# EAGLE design board (EAGLE 9.2.2)

## Sheet 1 of 4: MCU and Motors
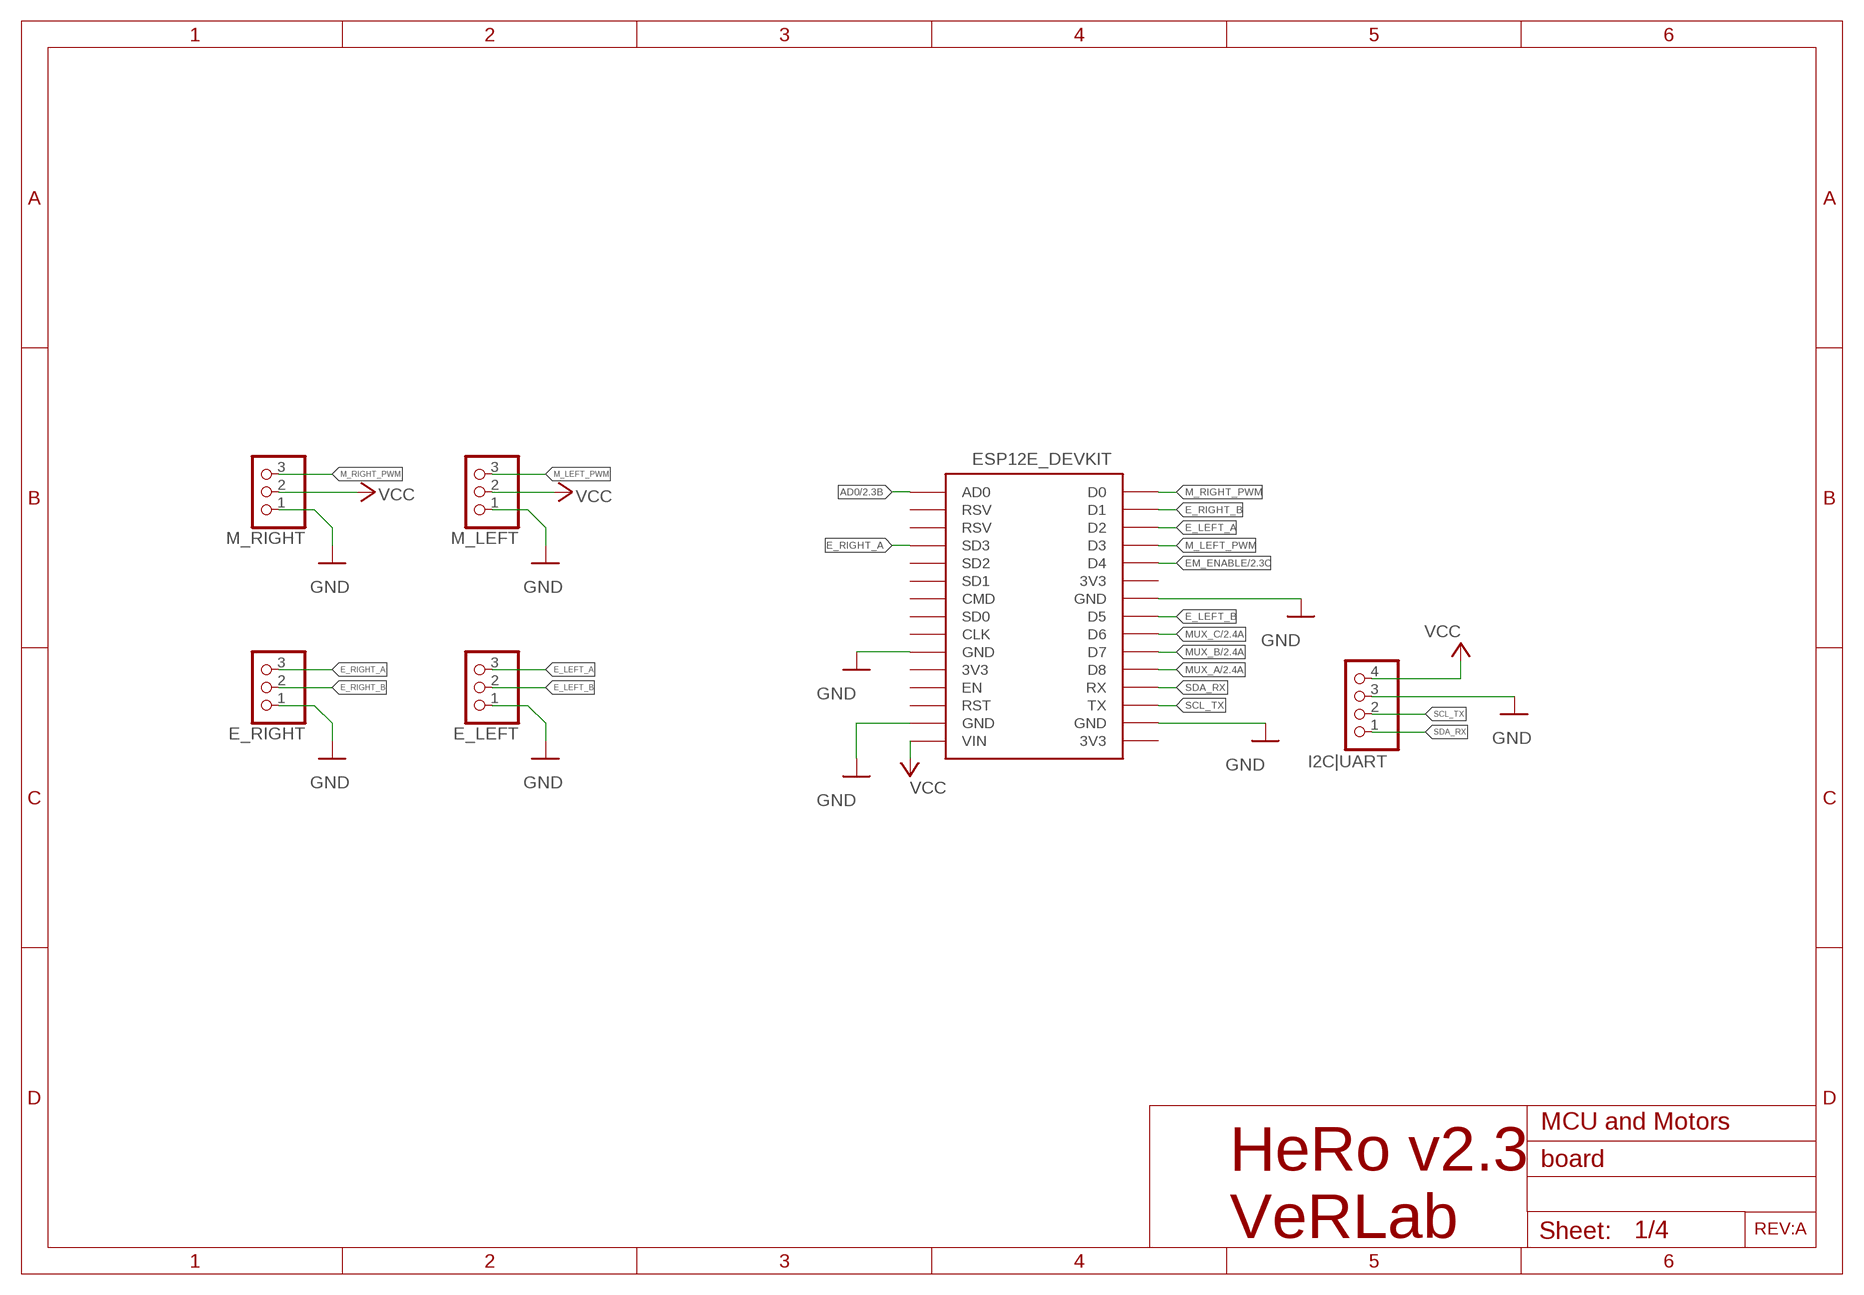
[diagram p0: schematic, sheet 1]
FRAME2 (A4L-LOC): TITLE: MCU and Motors

### Parts
E_LEFT  PINHD-1X3  [1X03]
E_RIGHT  PINHD-1X3  [1X03]
I2C|UART  PINHD-1X4  [1X04]
M_LEFT  PINHD-1X3  [1X03]
M_RIGHT  PINHD-1X3  [1X03]
U$1  ESP12E_DEVKIT  [ESP12E_DEVKIT]

### Nets
AD0: U$1.AD0 ; also sheet 2
E_LEFT_A: E_LEFT.3 U$1.D2
E_LEFT_B: E_LEFT.2 U$1.D5
E_RIGHT_A: E_RIGHT.3 U$1.SD3
E_RIGHT_B: E_RIGHT.2 U$1.D1
EM_ENABLE: U$1.D4 ; also sheet 2,3
GND: E_LEFT.1 E_RIGHT.1 I2C|UART.3 M_LEFT.1 M_RIGHT.1 U$1.GND@0(GND) U$1.GND@1(GND) U$1.GND@2(GND) U$1.GND@3(GND) ; also sheet 2,3,4
M_LEFT_PWM: M_LEFT.3 U$1.D3
M_RIGHT_PWM: M_RIGHT.3 U$1.D0
MUX_A: U$1.D8 ; also sheet 2
MUX_B: U$1.D7 ; also sheet 2
MUX_C: U$1.D6 ; also sheet 2
SCL_TX: I2C|UART.2 U$1.TX
SDA_RX: I2C|UART.1 U$1.RX
VCC: I2C|UART.4 M_LEFT.2 M_RIGHT.2 U$1.VIN ; also sheet 2,3,4
Unconnected: U$1.3V3@0(3V3) U$1.3V3@1(3V3) U$1.3V3@2(3V3) U$1.CLK U$1.CMD U$1.EN U$1.RST U$1.RSV@0(RSV) U$1.RSV@1(RSV) U$1.SD0 U$1.SD1 U$1.SD2

### Notes on the sheet
- REV:A
- HeRo v2.3
  VeRLab

## Sheet 2 of 4: Proximity Sensors
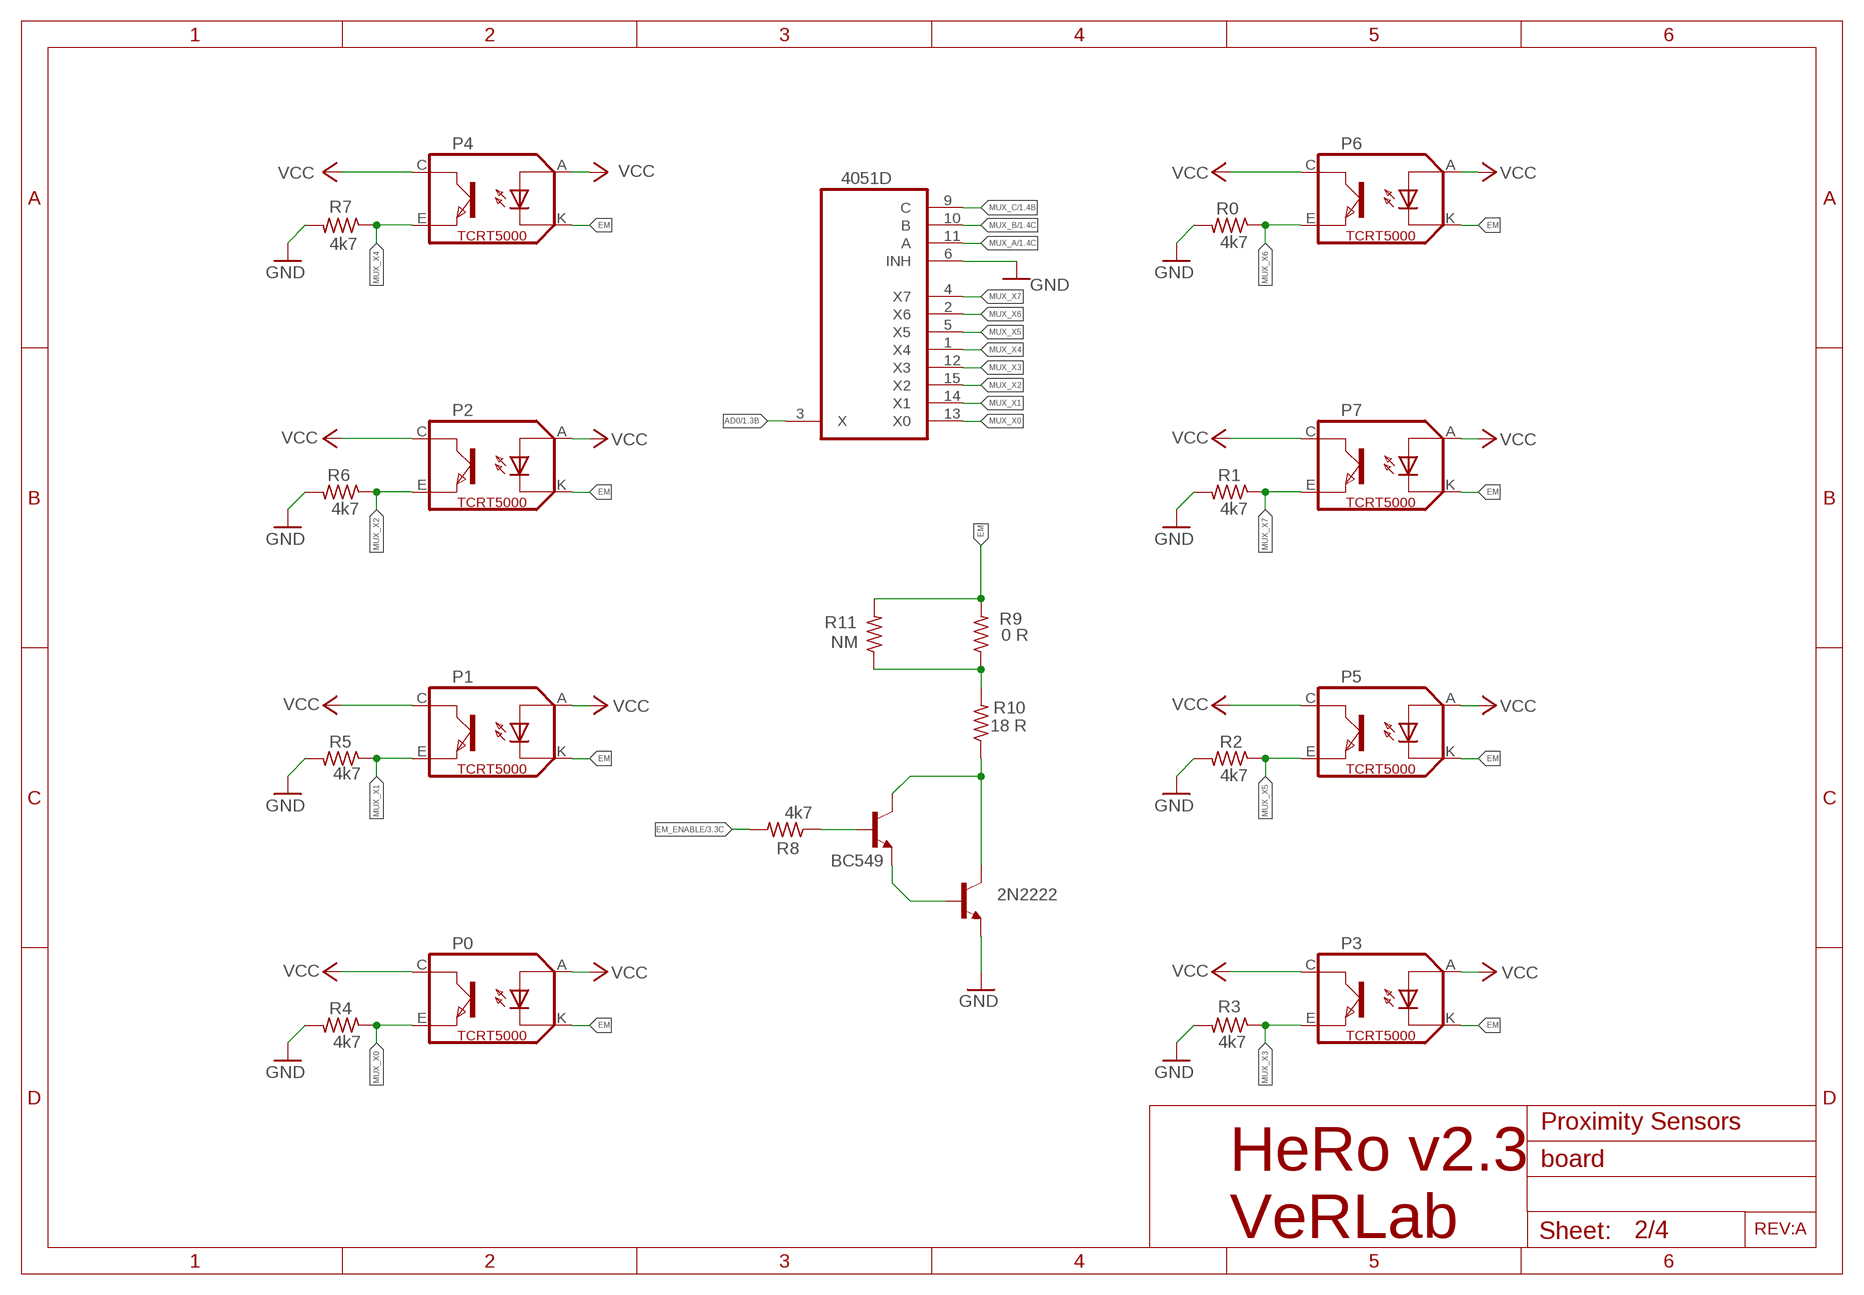
[diagram p1: schematic, sheet 2]
FRAME1 (A4L-LOC): TITLE: Proximity Sensors

### Parts
BC549  BC549-NPN-TO92-CBE  [TO92-CBE]
IC2  4051D  [SO16]
P0  TCRT5000  [TCRT5000]
P1  TCRT5000  [TCRT5000]
P2  TCRT5000  [TCRT5000]
P3  TCRT5000  [TCRT5000]
P4  TCRT5000  [TCRT5000]
P5  TCRT5000  [TCRT5000]
P6  TCRT5000  [TCRT5000]
P7  TCRT5000  [TCRT5000]
R0  4k7  R-US_M0805  [M0805]
R1  4k7  R-US_M0805  [M0805]
R2  4k7  R-US_M0805  [M0805]
R3  4k7  R-US_M0805  [M0805]
R4  4k7  R-US_M0805  [M0805]
R5  4k7  R-US_M0805  [M0805]
R6  4k7  R-US_M0805  [M0805]
R7  4k7  R-US_M0805  [M0805]
R8  4k7  R-US_R0805  [R0805]
R9  0 R  R-US_R0805  [R0805]
R10  18 R  R-US_R0805  [R0805]
R11  NM  R-US_R0805  [R0805]
T5  2N2222  [TO92-EBC-OVAL]

### Nets
AD0: IC2.3(X) ; also sheet 1
EM: P0.K(CATHODE) P1.K(CATHODE) P2.K(CATHODE) P3.K(CATHODE) P4.K(CATHODE) P5.K(CATHODE) P6.K(CATHODE) P7.K(CATHODE) R9.2 R11.2
EM_ENABLE: R8.2 ; also sheet 1,3
EM_ENABLE_RES: BC549.B R8.1
GND: IC2.6(INH) R0.2 R1.2 R2.2 R3.2 R4.2 R5.2 R6.2 R7.2 T5.E ; also sheet 1,3,4
MUX_A: IC2.11(A) ; also sheet 1
MUX_B: IC2.10(B) ; also sheet 1
MUX_C: IC2.9(C) ; also sheet 1
MUX_X0: IC2.13(X0) P0.E(EMITTER) R4.1
MUX_X1: IC2.14(X1) P1.E(EMITTER) R5.1
MUX_X2: IC2.15(X2) P2.E(EMITTER) R6.1
MUX_X3: IC2.12(X3) P3.E(EMITTER) R3.1
MUX_X4: IC2.1(X4) P4.E(EMITTER) R7.1
MUX_X5: IC2.5(X5) P5.E(EMITTER) R2.1
MUX_X6: IC2.2(X6) P6.E(EMITTER) R0.1
MUX_X7: IC2.4(X7) P7.E(EMITTER) R1.1
N$4: R9.1 R10.2 R11.1
N$6: BC549.C R10.1 T5.C
N$7: BC549.E T5.B
VCC: P0.A(ANODE) P0.C(COLLECTOR) P1.A(ANODE) P1.C(COLLECTOR) P2.A(ANODE) P2.C(COLLECTOR) P3.A(ANODE) P3.C(COLLECTOR) P4.A(ANODE) P4.C(COLLECTOR) P5.A(ANODE) P5.C(COLLECTOR) P6.A(ANODE) P6.C(COLLECTOR) P7.A(ANODE) P7.C(COLLECTOR) ; also sheet 1,3,4

### Notes on the sheet
- REV:A
- HeRo v2.3
  VeRLab

## Sheet 3 of 4: LED RGB
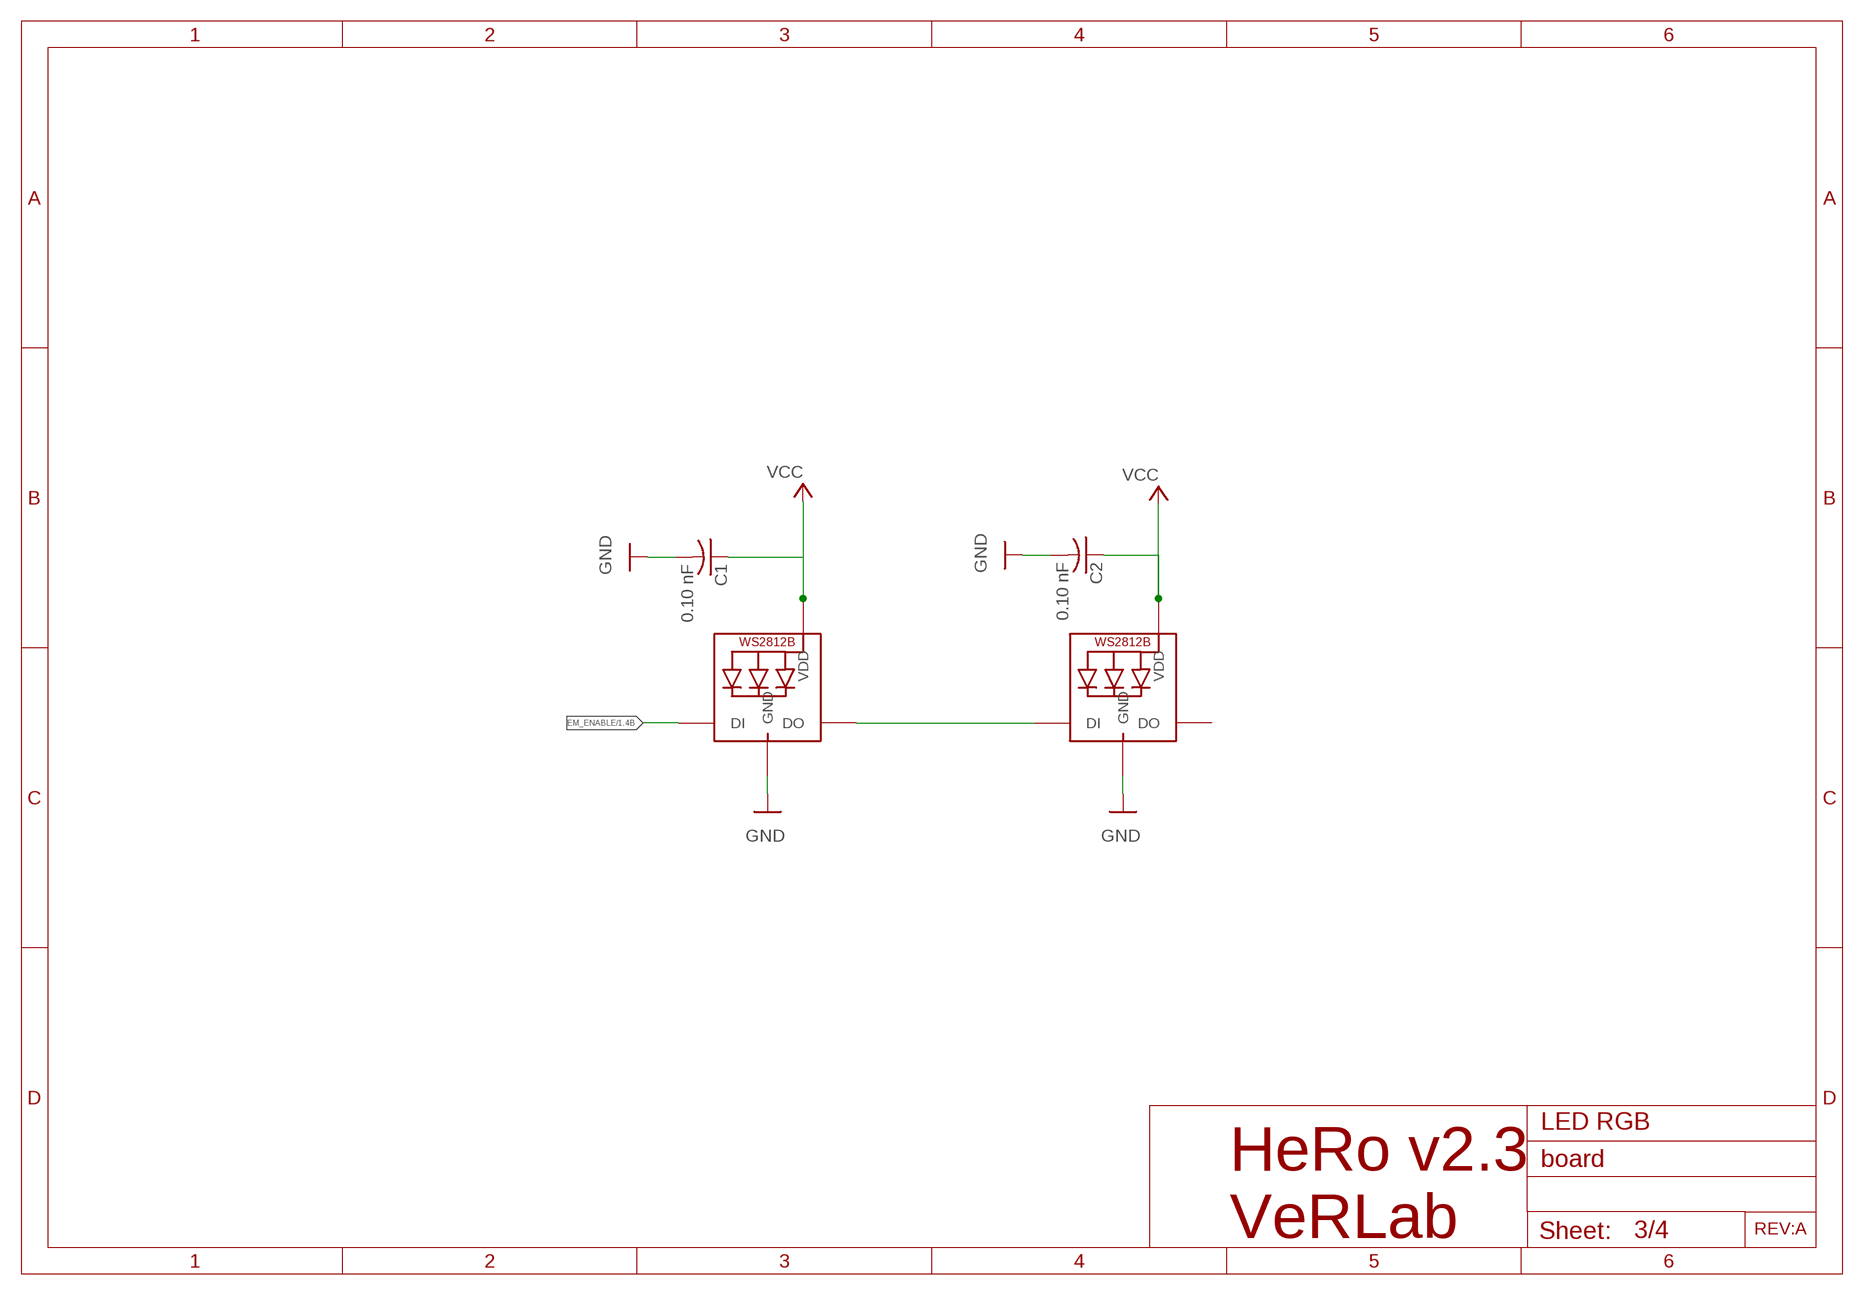
[diagram p2: schematic, sheet 3]
FRAME3 (A4L-LOC): TITLE: LED RGB

### Parts
C1  0.10 nF  C-USC0603  [C0603]
C2  0.10 nF  C-USC0603  [C0603]
LED3  WS2812B5050  [WS2812B]
LED4  WS2812B5050  [WS2812B]

### Nets
EM_ENABLE: LED3.4-DIN(DI) ; also sheet 1,2
GND: C1.2 C2.2 LED3.3-GND(GND) LED4.3-GND(GND) ; also sheet 1,2,4
VCC: C1.1 C2.1 LED3.1-VDD(VDD) LED4.1-VDD(VDD) ; also sheet 1,2,4
WS_OUT: LED3.2-DOUT(DO) LED4.4-DIN(DI)
Unconnected: LED4.2-DOUT(DO)

### Notes on the sheet
- REV:A
- HeRo v2.3
  VeRLab

## Sheet 4 of 4: Power Supply
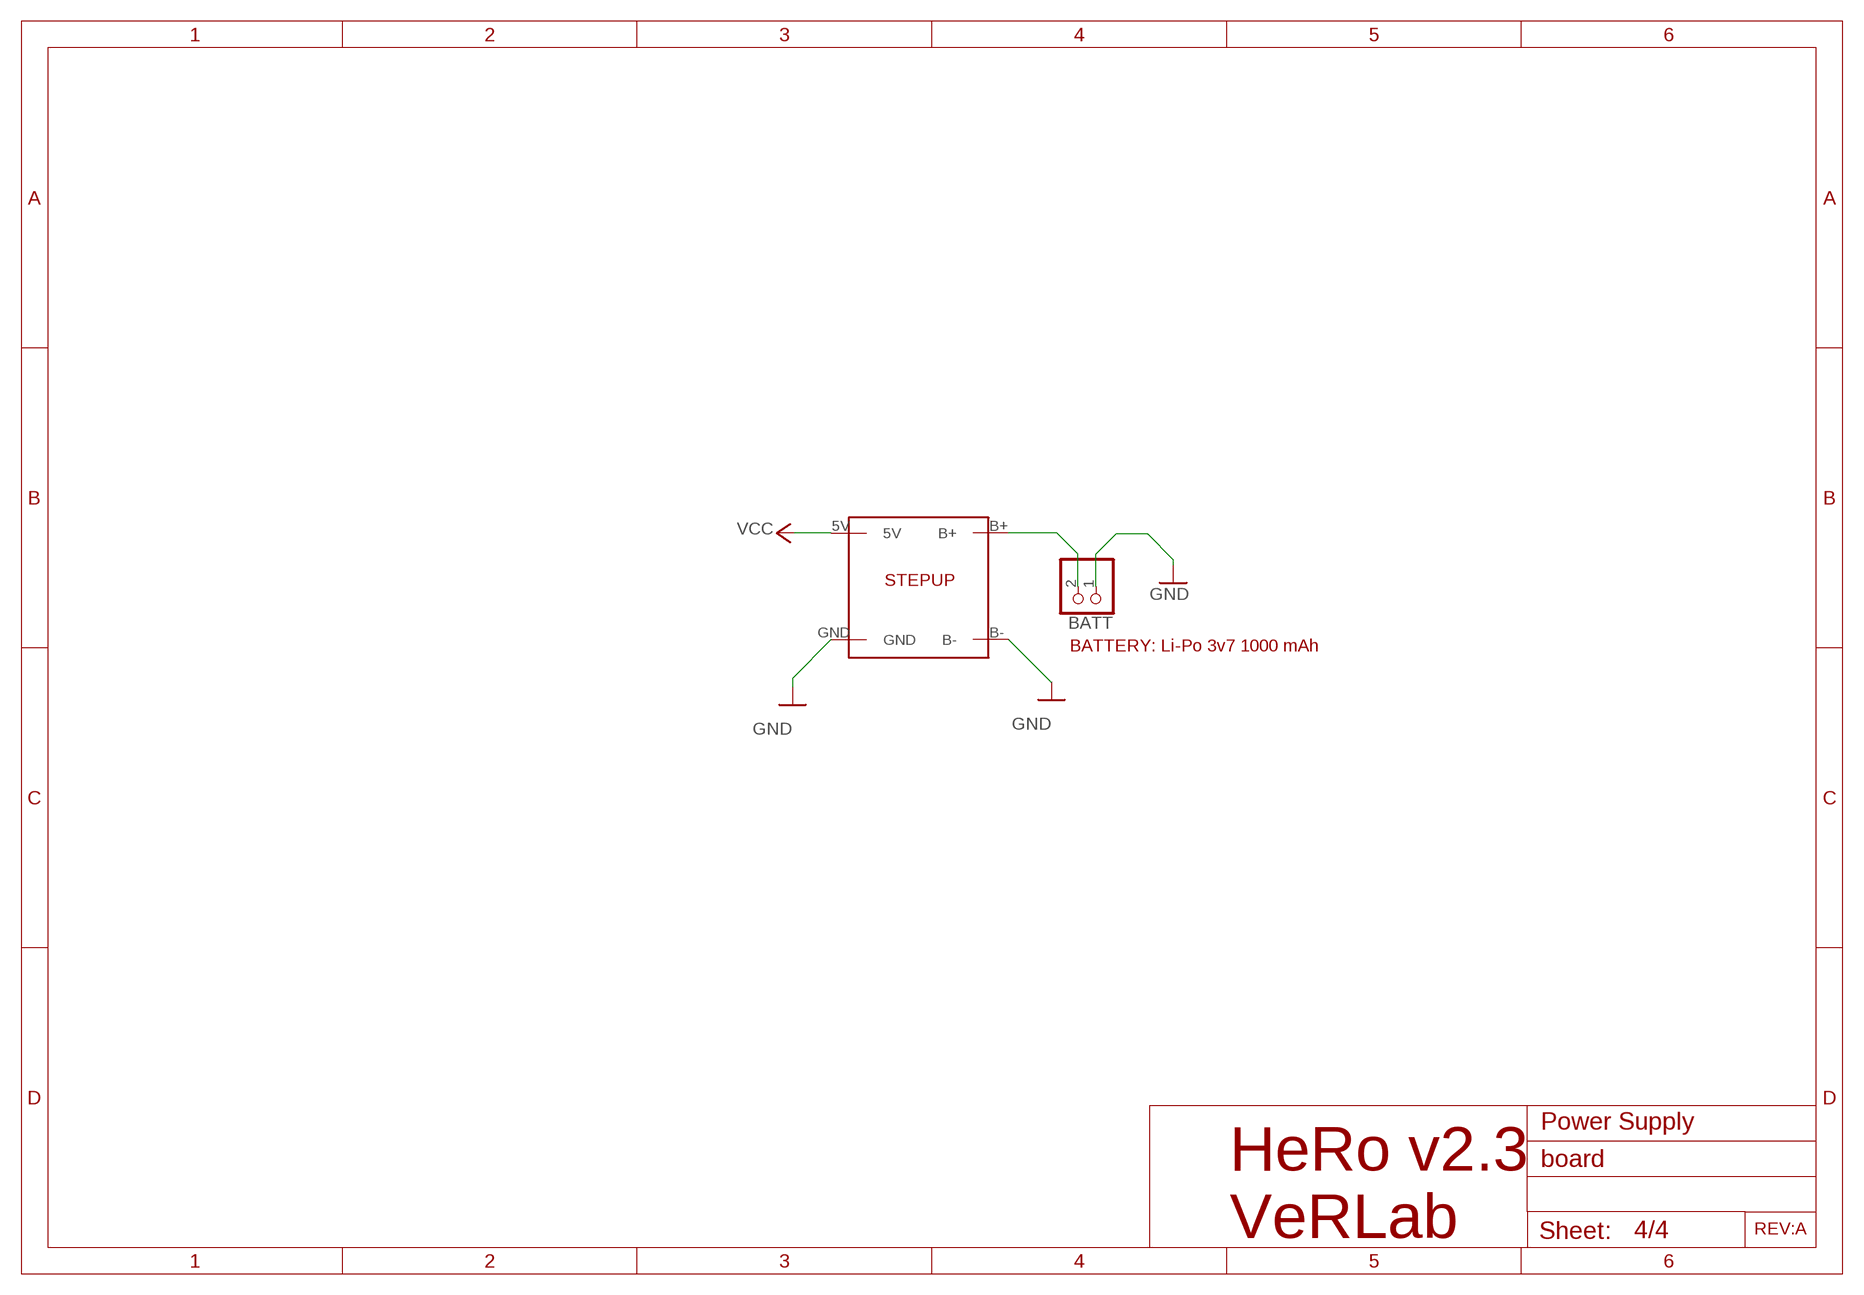
[diagram p3: schematic, sheet 4]
FRAME4 (A4L-LOC): TITLE: Power Supply

### Parts
BATT  PINHD-1X2  [1X02]
OS1  STEPUP  [STEPUP]

### Nets
B+: BATT.2 OS1.B+
GND: BATT.1 OS1.B- OS1.GND ; also sheet 1,2,3
VCC: OS1.5V ; also sheet 1,2,3

### Notes on the sheet
- BATTERY: Li-Po 3v7 1000 mAh
- REV:A
- HeRo v2.3
  VeRLab

## Power pins joined to a net without a drawn wire
GND: IC2.8(GND)
VCC: IC2.16(VCC)
VEE: IC2.7(VEE)

## Library data of the parts
BATT = pinhead:PINHD-1X2: PIN HEADER
BC549 = transistor:*-NPN-: NPN Transistror BF959 corrected 2008.03.06; SPICEPREFIX: J
C1 C2 = adafruit:C-US: CAPACITOR, American symbol
E_LEFT E_RIGHT M_LEFT M_RIGHT = pinhead:PINHD-1X3: PIN HEADER
I2C|UART = pinhead:PINHD-1X4: PIN HEADER
IC2 = 40xx:4051: 8-channel ANALOG MULTIPLEXER
LED3 LED4 = adafruit:WS2812B
OS1 = stepup:STEPUP
P0 P1-P7 = tcrt5000:TCRT5000
R0 R1-R7 = adafruit:R-US_: RESISTOR, American symbol
R8-R11 = resistor:R-US_: RESISTOR, American symbol; SPICEPREFIX: R
T5 = adafruit:2N2222: NPN TRANSISTOR Big oval pads; SPICEPREFIX: J
U$1 = ESP12E_DEVKIT:ESP12E_DEVKIT: ESP12E DEVKIT BOARD

## Net classes
0 default: width 0.508 mm, drill 0.508 mm, clearance 0.203 mm
1 gnd: width 0.508 mm, drill 0.508 mm, clearance 0.203 mm

## Board
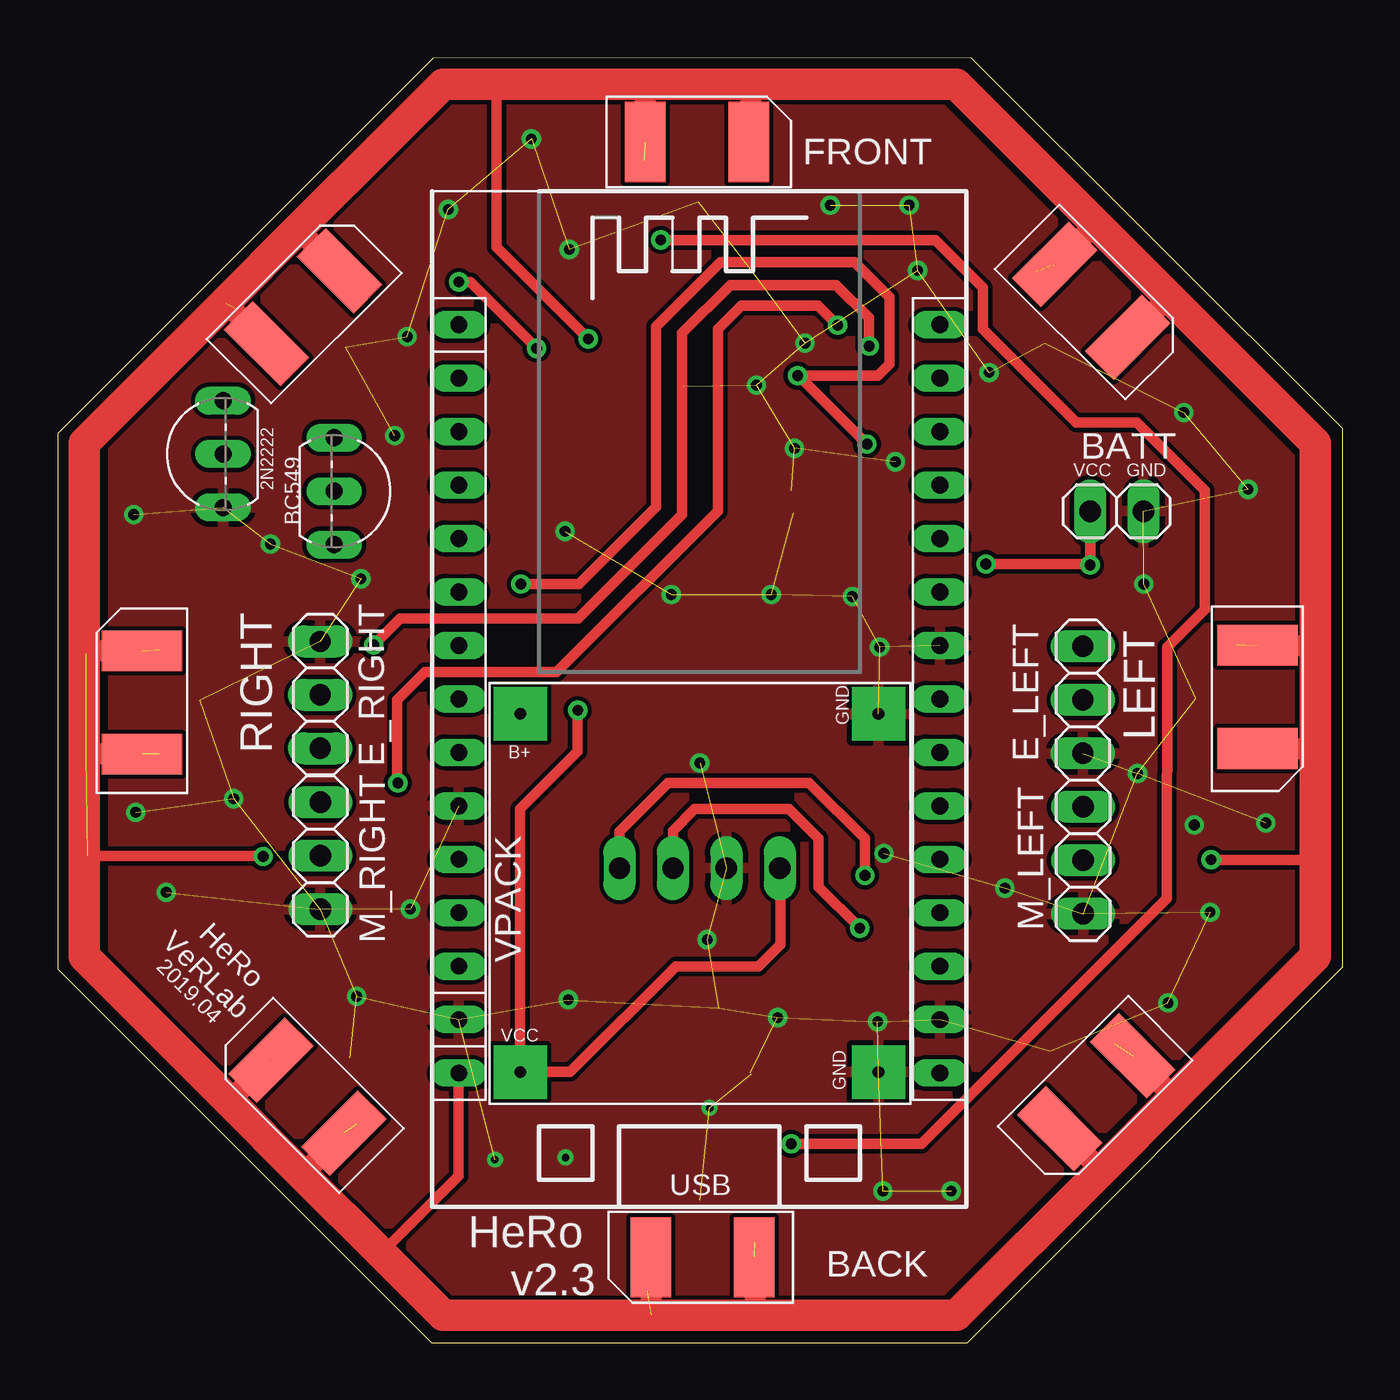
[diagram p4: board, top side]
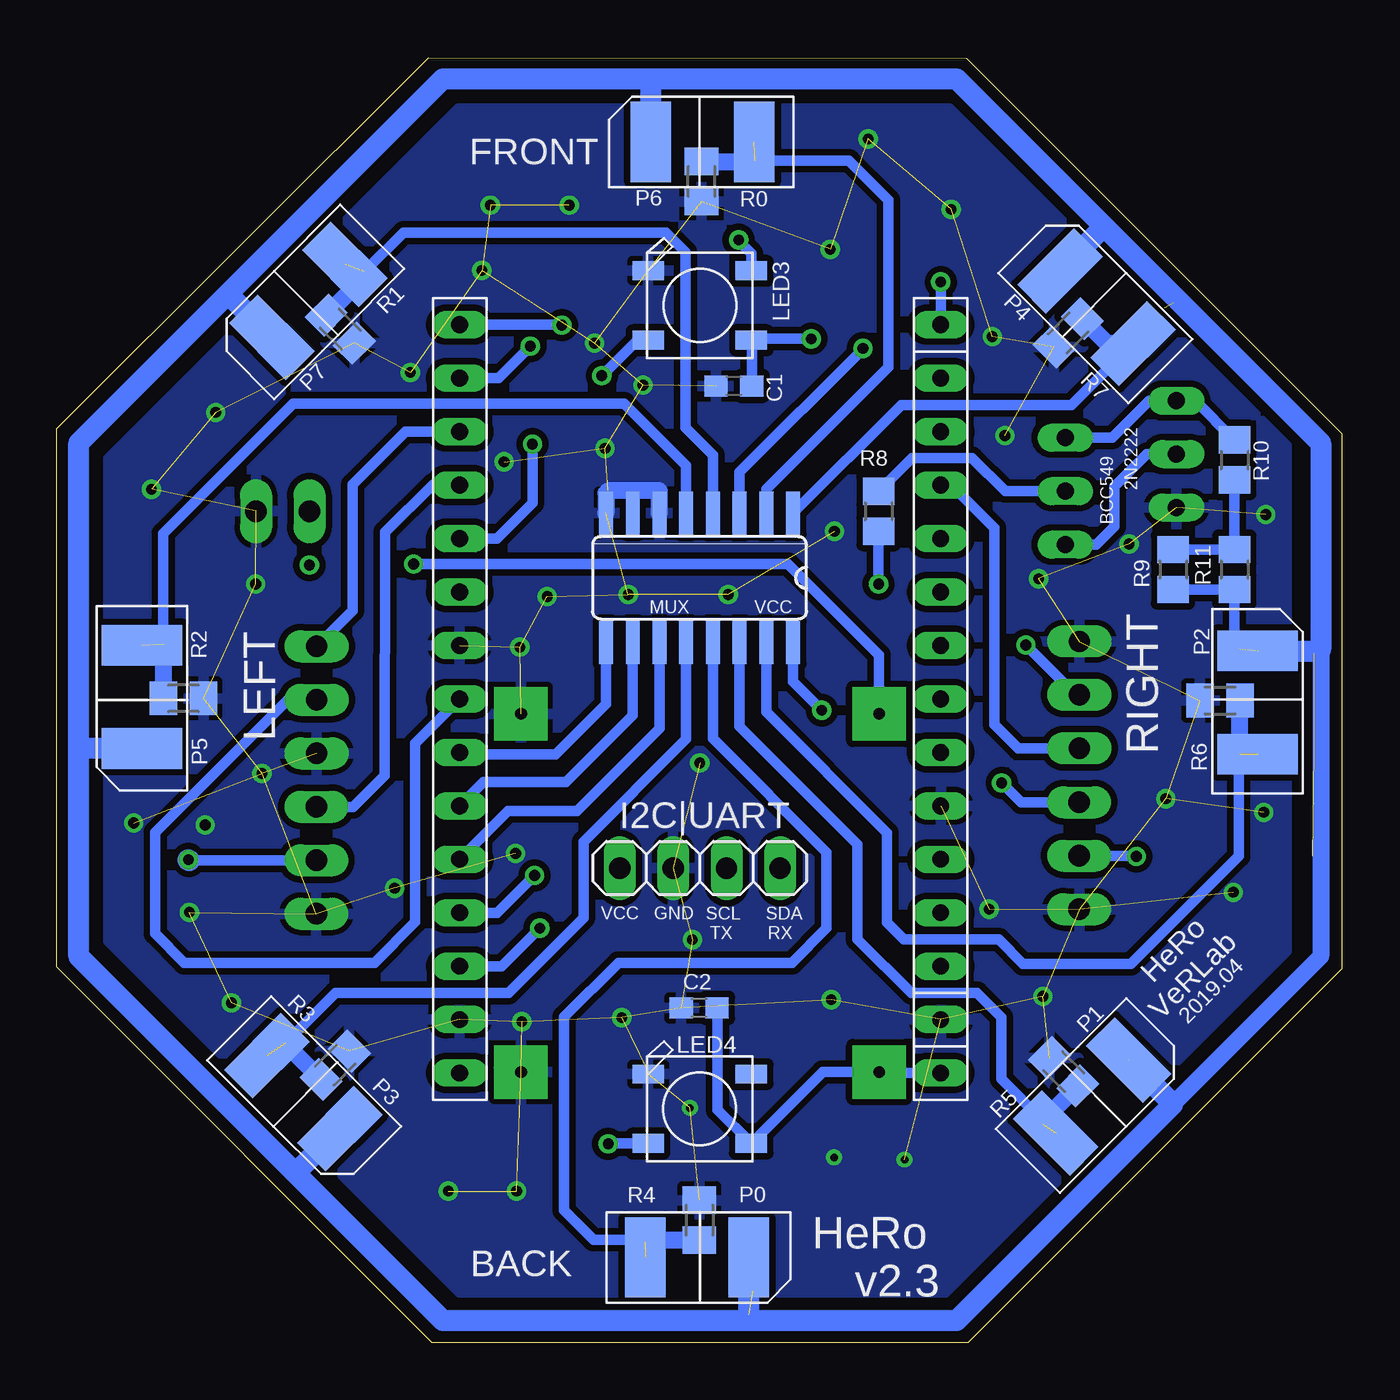
[diagram p5: board, bottom side, seen from below]

Size 61.06 x 61.06 mm. Coordinates in mm from the lower left corner, seen from the top.
Outline: 61.05,43.43 43.39,61.06 17.84,61.04 0,43.19 0,17.75 17.75,0 43.21,0 61.06,17.86 61.05,43.43
Copper layers (1*16): Top 0.035mm / dielectric 1.5mm / Bottom 0.035mm
Design rules "default": minimum track width 6mil, minimum drill 0.35mm, track to track 6mil, track to pad 6mil, pad to pad 6mil, via to via 6mil, smd to smd 6mil, copper to edge 40mil, drill to drill 6mil, minimum pad ring 10mil, minimum via ring 8mil, stop-mask expansion 4mil, vias tented up to drill 0mil, thermal gap 10mil

### Footprints (pad centres in the part's own frame; a part is rotated, then mirrored left to right if it is on the bottom)
1X02 = drill 1.016 long: 1 -1.27,0; 2 1.27,0
TO92-CBE = drill 0.813 long: B 0,0; C -2.54,0; E 2.54,0
C0603 = smd 1.1 x 1: 1 -0.85,0; 2 0.85,0
1X03 = drill 1.016 long: 1 -2.54,0; 2 0,0; 3 2.54,0
1X04 = drill 1.016 long: 1 -3.81,0; 2 -1.27,0; 3 1.27,0; 4 3.81,0
SO16 = smd 0.66 x 2.032: 1 -4.445,-3.073; 2 -3.175,-3.073; 3 -1.905,-3.073; 4 -0.635,-3.073; 5 0.635,-3.073; 6 1.905,-3.073; 7 3.175,-3.073; 8 4.445,-3.073; 9 4.445,3.073; 10 3.175,3.073; 11 1.905,3.073; 12 0.635,3.073; 13 -0.635,3.073; 14 -1.905,3.073; 15 -3.175,3.073; 16 -4.445,3.073
WS2812B = smd 1.5 x 0.9: 1-VDD 2.45,-1.65; 2-DOUT 2.45,1.65; 3-GND -2.45,1.65; 4-DIN -2.45,-1.65
STEPUP = drill 0.55 pad 2.54 square: 5V -8.484,8.534; B+ 8.534,8.534; B- 8.534,-8.484; GND -8.484,-8.484
TCRT5000 = smd 1.93 x 3.81: A -2.311,0; C 2.591,0 | smd 1.93 x 3.81 bottom: E 2.591,0; K -2.311,0
M0805 = smd 1.3 x 1.6: 1 -0.95,0; 2 0.95,0
R0805 = smd 1.3 x 1.5: 1 -0.95,0; 2 0.95,0
TO92-EBC-OVAL = drill 0.813 long: B 0,-1.27; C 2.54,-1.27; E -2.54,-1.27
ESP12E_DEVKIT = drill 0.8 pad 1.27 long: 3V3@0 -11.43,-7.62; 3V3@1 11.43,5.08; 3V3@2 11.43,-17.78; AD0 -11.43,17.78; CLK -11.43,-2.54; CMD -11.43,2.54; D0 11.43,17.78; D1 11.43,15.24; D2 11.43,12.7; D3 11.43,10.16; D4 11.43,7.62; D5 11.43,0; D6 11.43,-2.54; D7 11.43,-5.08; D8 11.43,-7.62; EN -11.43,-10.16; GND@0 -11.43,-5.08; GND@1 -11.43,-15.24; GND@2 11.43,2.54; GND@3 11.43,-15.24; RST -11.43,-12.7; RSV@0 -11.43,15.24; RSV@1 -11.43,12.7; RX 11.43,-10.16; SD0 -11.43,0; SD1 -11.43,5.08; SD2 -11.43,7.62; SD3 -11.43,10.16; TX 11.43,-12.7; VIN -11.43,-17.78

### Placement (x,y rotation side)
BATT  50.32,39.51 180 top
BC549  13.13,40.46 270 top
C1  28.88,45.46 180 bottom
C2  30.53,15.91 180 bottom
E_LEFT  48.71,30.55 90 top
E_RIGHT  12.46,30.78 270 top
I2C|UART  30.5,22.55 180 bottom
IC2  30.51,36.34 180 bottom
LED3  30.5,49.29 0 bottom
LED4  30.51,11.11 0 bottom
M_LEFT  48.72,22.92 90 top
M_RIGHT  12.47,23.14 90 top
OS1  30.51,21.35 90 top
P0  30.49,4.06 0 top
P1  11.75,11.79 315 top
P2  4,30.56 270 top
P3  49.24,11.8 45 top
P4  11.75,49.3 225 top
P5  57,30.55 90 top
P6  30.51,57.05 180 top
P7  49.21,49.41 135 top
R0  30.42,55.18 270 bottom
R1  47.58,48.16 315 bottom
R2  55.03,30.62 0 bottom
R3  47.82,13.18 45 bottom
R4  30.52,5.83 90 bottom
R5  13.21,12.87 135 bottom
R6  5.78,30.51 180 bottom
R7  12.99,47.98 225 bottom
R8  22,39.51 270 bottom
R9  8.01,36.74 270 bottom
R10  5.09,41.94 270 bottom
R11  5.09,36.74 270 bottom
T5  6.58,42.22 90 top
U$1  30.48,30.59 0 top

### Tracks (layer width: path | path; a pad name or v marks a point on that pad's centre or on a via)
AD0  (via drill 0.51 pad 0.51)
  Top 0.508: v22.75,47.25 19.6,50.4 v19.05,50.4
  Bottom 0.508: IC2.3 28.61,41.37 22.75,47.22 v22.75,47.25 | U$1.AD0 v19.05,50.4
B+  (via drill 0.51 pad 0.51)
  Top 0.508: v44.1,37 49,37 v49.05,36.95 BATT.2
  Bottom 0.508: OS1.B+ 21.98,32.66 26.31,37 v44.1,37
E_LEFT_A
  Bottom 0.508: 41.91,43.05 U$1.D2 44.48,43.29 47,40.76 47,34.79 E_LEFT.3
E_LEFT_B
  Bottom 0.508: U$1.D5 44.02,28.48 44.02,19.99 45.96,18.04 54.99,18.04 56.39,19.44 56.39,24.24 50.08,30.55 E_LEFT.2
E_RIGHT_A
  Bottom 0.508: 18.54,40.75 16.49,38.7 16.49,29.38 15.35,28.24 E_RIGHT.3
  Bottom 0.813: U$1.SD3 18.54,40.75
E_RIGHT_B  (via drill 0.51 pad 0.51)
  Top 0.508: v15,33.15 16.25,34.4 24.73,34.4 29.67,39.34 29.67,47.97 31.96,50.26 36.97,50.26 38.53,48.7 38.53,47.37 v38.55,47.35
  Bottom 0.508: v15,33.15 12.63,30.78 E_RIGHT.2 | U$1.D1 40.07,45.83 v38.55,47.35
EM  (2 unrouted)
  Bottom 0.508: P2.K 3.98,32.85 | R9.2 R11.2 5.09,33.18
  Bottom 0.813: P2.K 1.06,32.87 1,32.93 1,18.35 8.03,11.32 | 5.09,33.18 4.84,32.93
  Bottom 1: 28.14,1.05 18.3,1.05 8.03,11.32 8.03,11.34 P1.K | 28.14,1.05 42.7,1.05 49.79,8.14 | 49.79,8.14 60,18.35 60,28.18 | 60,28.18 60,42.75 52.9,49.85 | 52.9,49.85 42.7,60.05 32.8,60.05 | 32.8,60.05 18.3,60.05 11.26,53 | 11.26,53 1,42.75 1,32.93 | P2.K 1.34,32.87 1.32,32.85 | P4.K 11.32,53 11.26,53 | P7.K 52.9,49.83 52.9,49.85 | P3.K 49.63,8.14 49.79,8.14 | P0.K 28.18,1.09 28.14,1.05 | P5.K 59.94,28.23 60,28.18 | P6.K 32.82,60.03 32.8,60.05
EM_ENABLE  (via drill 0.51 pad 0.51)
  Top 0.508: v38.45,42.7 35.2,45.95 v35.15,45.95 38.97,45.95 39.52,46.5 39.52,49.68 37.85,51.34 31.48,51.34 28.42,48.28 28.42,39.7 24.76,36.05 v22,36.05
  Bottom 0.508: U$1.D4 40.14,38.21 38.45,39.9 v38.45,42.7 | v35.15,45.95 33.47,47.64 LED3.4-DIN | v22,36.05 R8.2
  Bottom 0.813: LED3.4-DIN 33.16,47.64 | 21.98,38.54 R8.2
EM_ENABLE_RES
  Bottom 0.508: R8.1 20.42,42.03 17.56,42.03 15.99,40.46 BC549.B
GND  (via drill 0.35, 0.51)  (69 unrouted)
  Bottom 0.508: C1.2 29.6,45.59 | C2.2 | 32.9,12.82 LED4.3-GND
  Bottom 0.813: IC2.6 32.42,40.48 34.85,40.48 34.96,40.37 34.96,39.43 IC2.8
  other vias: 34.2,15.45 30.85,19.15 20.77,8.7 30.97,11.15 38.95,15.25 39.2,7.2 42.45,7.2 24.25,16.3 39.05,33.05 33.9,35.55 29.15,35.55 5.15,21.4 16.75,20.6 8.35,25.85 3.7,25.2 14.4,36.3 16,43.1 16.6,47.8 51.6,36.05 45,21.6 51.3,27.05 57.4,24.7 56.55,40.55 35,42.5 33.2,45.5 24.3,51.95 40.45,54.05 36.7,54.05 18.55,53.85 53.5,44.2 40.85,50.95 37.75,35.45 10.1,37.95 30.5,27.55 14.2,16.45 22.5,57.2 3.6,39.35 52.75,16.15 54.75,20.45 39.8,41.85 44.25,46.1 35.5,47.5 39.25,23.25 24.1,38.55 24.12,8.8 54,24.6
  pour Top: 18.81,2.42 41.95,2.42 58.63,19.1 58.63,41.98 41.95,58.66 18.66,58.66 2.62,42.62 2.62,18.6
  pour Bottom (isolate 0.305): 18.82,2.39 41.91,2.39 58.62,19.1 58.62,42 41.99,58.63 18.62,58.63 2.61,42.62 2.61,18.6
M_LEFT_PWM
  Bottom 0.508: U$1.D3 43.21,40.75 45.44,38.51 45.48,26.96 46.98,25.46 M_LEFT.3
M_RIGHT_PWM  (via drill 0.51 pad 0.51)
  Top 0.508: 16.15,26.7 v16.15,26.6 16.13,26.62 16.13,30.54 17.45,31.86 23.7,31.86 31.37,39.53 31.37,48.17 32.48,49.28 36.13,49.28 v37.05,48.35
  Bottom 0.508: M_RIGHT.3 15.23,25.68 v16.15,26.6 | v37.05,48.35 37.07,48.37 U$1.D0
MUX_A
  Bottom 0.508: IC2.11 32.42,29.18 36.32,25.27 39.61,25.27 U$1.D8
MUX_B
  Bottom 0.508: U$1.D7 40.78,26.64 36.86,26.64 33.69,29.81 IC2.10
MUX_C
  Bottom 0.508: IC2.9 34.96,30.36 37.36,27.95 41.82,27.95
  Bottom 0.813: 41.82,27.95 U$1.D6
MUX_X0  (1 unrouted)
  Bottom 0.508: IC2.13 29.88,28.7 24.47,23.3 24.47,19.71 26.12,18.06 34.37,18.06 36.95,15.48 36.95,6.29 35.55,4.9 33.93,4.9 P0.E
  Bottom 0.813: R4.1 33.02,4.88 33.11,4.78
MUX_X1  (1 unrouted)
  Bottom 0.508: IC2.14 28.61,29.29 23,23.68 23,19.17 20.45,16.62 17.34,16.62 16.17,15.45 16.17,12.53 14.19,10.55
  Bottom 0.813: R5.1 14.19,10.55 14.19,10.37
MUX_X2  (1 unrouted)
  Bottom 0.508: R6.1 4.86,30.48 | IC2.15 27.34,29.96 21.6,24.23 21.6,19.97 20.79,19.16 16.29,19.16 15.14,18 10.01,18 4.89,23.12 4.89,27.92
  Bottom 0.813: R6.1 4.89,30.45 4.84,30.4 4.84,27.97 4.89,27.92
MUX_X3  (1 unrouted)
  Bottom 0.508: IC2.12 31.15,28.68 36.03,23.8 36.03,20.18 39.59,16.62 47.8,16.62 50.2,14.22
  Bottom 0.813: 50.2,14.22 R3.1
MUX_X4
  Bottom 0.508: IC2.1 20.92,44.56 12.83,44.56 P4.E
  Bottom 0.813: P4.E 11.14,47.47 R7.1
MUX_X5  (1 unrouted)
  Bottom 0.508: 55.98,32.99 55.98,33.17 56,33.18 56,38.44 49.82,44.62 34.09,44.62 31.15,41.67 IC2.5
  Bottom 0.813: R2.1 55.98,33.17
MUX_X6  (1 unrouted)
  Bottom 0.508: 27.92,56.13 27.88,56.17 23.42,56.17 21.54,54.29 21.54,46.35 22.75,45.14 27.34,40.56 IC2.2
  Bottom 0.813: R0.1 27.92,56.13
MUX_X7  (1 unrouted)
  Bottom 0.508: 46.44,50.64 46.44,50.89 44.58,52.75 32.11,52.75 31.18,51.83 31.18,43.48 29.88,42.18 IC2.4
  Bottom 0.813: R1.1 46.44,50.64
N$4
  Bottom 0.508: R10.2 R11.1 R9.1
N$6
  Bottom 0.508: 6.96,44.76 R10.1 | BC549.C 10.9,43 9.13,44.76 T5.C
  Bottom 0.813: T5.C 7.28,44.76 | 7.22,44.76 T5.C | T5.C 6.96,44.76
N$7
  Bottom 0.508: BC549.E 11.66,37.92 10.81,38.77 10.81,40.67 9.26,42.22 T5.B
SCL_TX  (via drill 0.51)
  Top 0.508: I2C|UART.2 29.23,24.33 30.25,25.35 34.75,25.35 36.15,23.95 36.15,21.65 v38.1,19.7
  Bottom 0.508: U$1.TX 39.91,17.89 v38.1,19.7
SDA_RX  (via drill 0.51)
  Top 0.508: I2C|UART.1 26.69,24.29 29,26.6 35.7,26.6 38.35,23.95 v38.35,22.2
  Bottom 0.508: U$1.RX 40.12,20.43 v38.35,22.2
VCC  (via drill 0.51 pad 0.51)  (6 unrouted)
  Top 0.508: P1.C 13.59,9.75 | P0.C 33.08,4.06 | P0.A 28.19,4.06 | P5.C 57.12,33.26 | 57.07,28.3 P5.A | 8.42,48.98 8.42,49.16 | P2.A 3.93,32.8 | 3.82,27.8 P2.C | 28.18,2.62 28,2.45 | U$1.VIN 19.05,7.92 15.37,4.24 | 59.74,38.16 59.75,38.15 | 15.91,57.31 15.81,57.31 | 24.05,59.75 24,59.8 | OS1.5V 24.34,12.87 29.36,17.89 33.3,17.89 34.34,18.93 34.34,22.52 | 21.96,12.88 21.96,25.37 24.69,28.1 24.69,30.04 v24.7,30.05 | v54.8,22.95 59.66,22.95 | v9.75,23.1 9.72,23.14 1.39,23.14 | v25.2,47.7 20.85,52.05 20.85,59.8
  Top 0.813: 34.34,22.52 I2C|UART.4 | 21.96,12.88 OS1.5V 21.98,12.86 | 59.7,22.81 59.75,22.86
  Top 1: P2.A 1.37,32.87 1.32,32.82 1.32,32.75 | P2.C 1.34,27.97 1.33,27.97 | P1.A 8.27,11.58 8.03,11.58 | P1.C 11.63,8.01 11.59,8.01 | P3.A 49.55,8.22 49.55,8.15 | P3.C 53.03,11.67 53.03,11.63 | 57.05,28.28 P5.A 59.59,28.23 59.75,28.08 | 59.59,33.31 59.59,33.14 59.58,33.14 P5.C 59.71,33.14 59.75,33.09 | P7.A 52.78,49.71 52.79,49.71 | P7.C 49.2,53.06 49.44,53.06 | P6.A 32.93,57.17 32.93,59.8 | P6.C 27.92,59.61 28.11,59.8 | P4.A 11.45,52.88 11.38,52.88 | P4.C 8,49.39 8,49.5 | 28.11,3.98 P0.A 28.18,1.33 28.21,1.3 | P0.C 33.12,4.02 33.12,1.3
  Top 1.016: 59.66,22.95 59.75,22.86 | 1.39,23.14 1.25,23
  Top 1.5: 18.3,1.3 28.21,1.3 33.12,1.3 42.7,1.3 49.55,8.15 53.03,11.63 59.75,18.35 59.75,22.86 59.75,28.08 59.75,33.09 59.75,38.15 59.75,42.75 52.79,49.71 49.44,53.06 42.7,59.8 32.93,59.8 28.11,59.8 24,59.8 20.85,59.8 18.3,59.8 15.81,57.31 11.38,52.88 8,49.5 1.25,42.75 1.25,23 1.25,18.35 8.03,11.58 11.59,8.01 15.37,4.24 18.3,1.3
  Bottom 0.508: C1.1 28.03,47.62 27.95,47.7 v25.2,47.7 | 29.67,15.9 29.67,11.08 LED4.1-VDD 24.65,12.87 OS1.5V 21.92,12.81 U$1.VIN | M_LEFT.2 54.77,22.92 | v24.7,30.05 26.07,31.41 IC2.16 | v9.75,23.1 9.79,23.14 M_RIGHT.2
  Bottom 0.813: 29.67,15.9 C2.1 | 27.99,47.7 LED3.1-VDD 28.03,47.62
  Bottom 1.016: 54.77,22.92 v54.8,22.95
WS_OUT  (via drill 0.51, 0.51 pad 0.51)
  Top 0.508: v34.85,9.45 41.03,9.45 52.7,21.12 52.72,33.06 54.5,34.83 54.5,40.5 51.27,43.72 48.4,43.72 43.96,48.17 43.96,50.14 41.7,52.4 v28.65,52.4
  Bottom 0.508: 33.06,9.57 LED4.4-DIN 34.84,9.46 v34.85,9.45 | LED3.2-DOUT 28.05,51.75 28.65,52.35 v28.65,52.4

### Text on the board
tNames: FRONT | 2N2222 | VCC GND | RIGHT | LEFT | GND | B+ | HeRo / VeRLab | 2019.04 | VCC | GND | USB | HeRo / v2.3 | BACK
bNames: FRONT | 2N2222 | BCC549 | RIGHT | MUX VCC | LEFT | SCL SDA / TX RX | VCC GND | HeRo / VeRLab | 2019.04 | HeRo / v2.3 | BACK
tValues: RIGHT